# Altium schematic sheet OPA4227.SchDoc
size A4
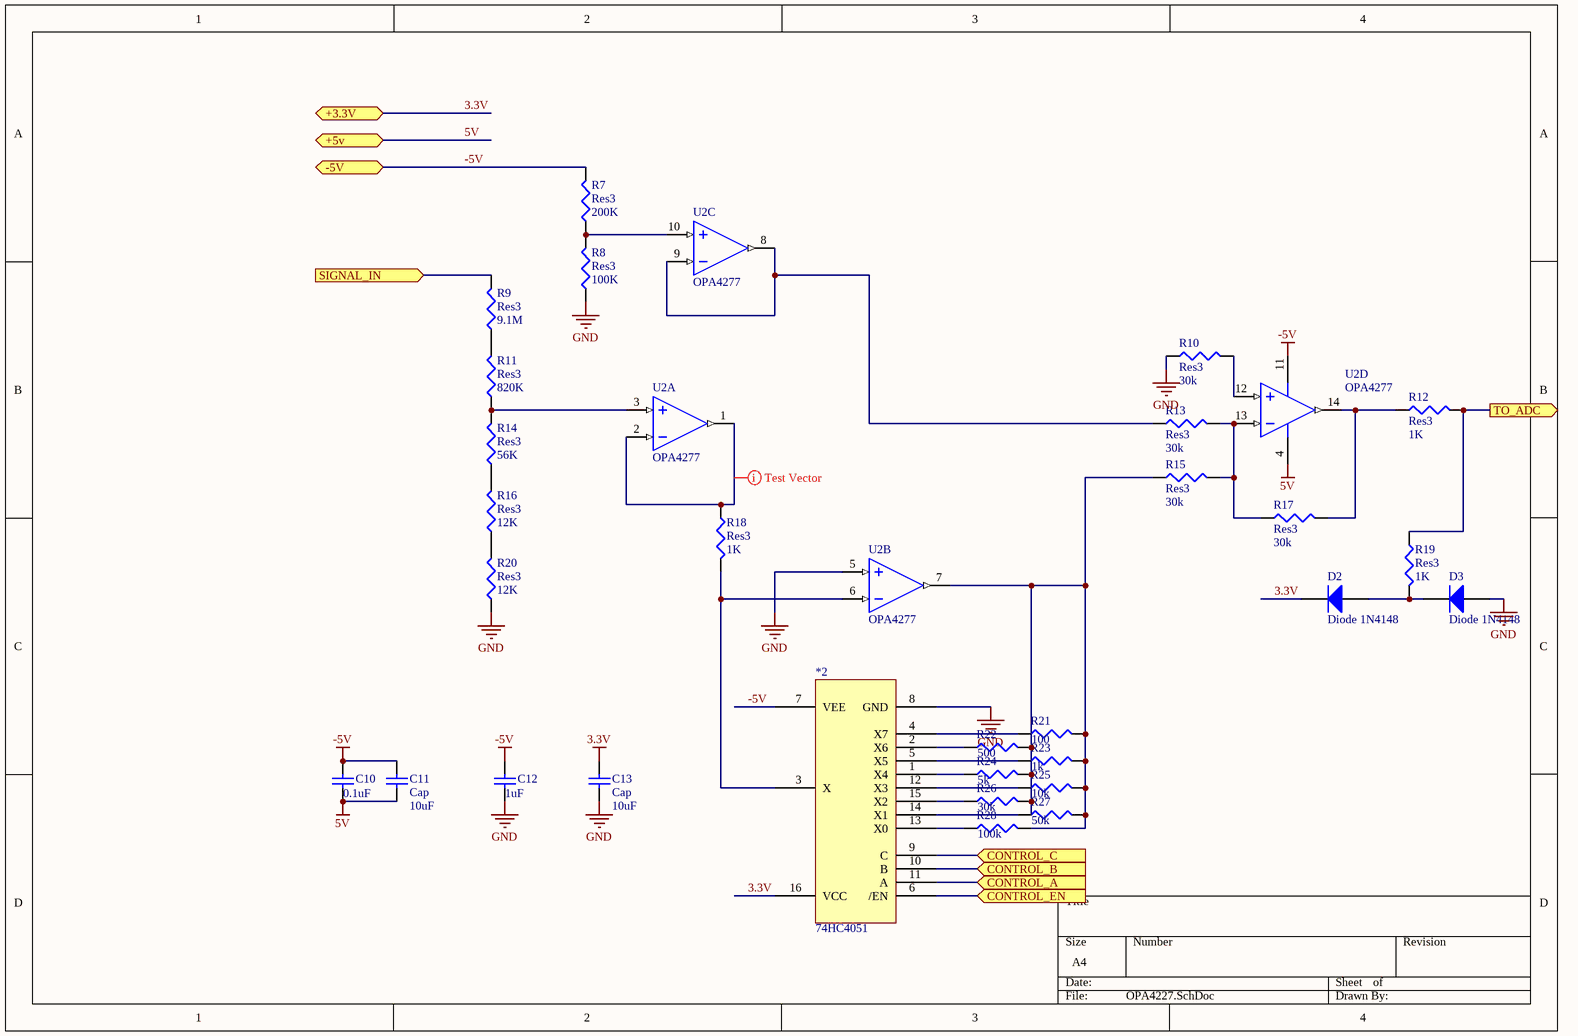
[diagram p0: OPA4227.SchDoc]

## Parts
*2  74HC4051  [SOP-16]
C10  value 0.1uF  [CAP_0603]  (hidden comment: Cap)
C11  Cap  value 10uF  [CAP_0603]
C12  value 1uF  [CAP_0603]  (hidden comment: Cap)
C13  Cap  value 10uF  [CAP_0603]
D2  Diode 1N4148  [DO-35]
D3  Diode 1N4148  [DO-35]
R7  Res3  value 200K  [RES_0603]
R8  Res3  value 100K  [RES_0603]
R9  Res3  value 9.1M  [RES_0603]
R10  Res3  value 30k  [RES_0603]
R11  Res3  value 820K  [RES_0603]
R12  Res3  value 1K  [RES_0603]
R13  Res3  value 30k  [RES_0603]
R14  Res3  value 56K  [RES_0603]
R15  Res3  value 30k  [RES_0603]
R16  Res3  value 12K  [RES_0603]
R17  Res3  value 30k  [RES_0603]
R18  Res3  value 1K  [RES_0603]
R19  Res3  value 1K  [RES_0603]
R20  Res3  value 12K  [RES_0603]
R21  value 100  [RES_0603]  (hidden comment: Res3)
R22  value 500  [RES_0603]  (hidden comment: Res3)
R23  value 1k  [RES_0603]  (hidden comment: Res3)
R24  value 5k  [RES_0603]  (hidden comment: Res3)
R25  value 10k  [RES_0603]  (hidden comment: Res3)
R26  value 30k  [RES_0603]  (hidden comment: Res3)
R27  value 50k  [RES_0603]  (hidden comment: Res3)
R28  value 100k  [RES_0603]  (hidden comment: Res3)
U2  OPA4277  [SO-14]  (parts A,B,C,D of 4)

## Ports
+3.3V, +5v, -5V, CONTROL_A (in), CONTROL_B (in), CONTROL_C (in), CONTROL_EN (in), SIGNAL_IN (in), TO_ADC (out)

## Nets
3.3V: *2.16(VCC) C13.2 D2.2(K) ; port +3.3V
5V: C10.1 C11.1 U2.4(V+) ; port +5v
-5V: *2.7(VEE) C10.2 C11.2 C12.2 R7.2 U2.11(V-) ; port -5V
GND: *2.8(GND) C12.1 C13.1 D3.1(A) R8.1 R10.1 R20.1 U2.5(IN+)
CONTROL_A: *2.11(A) ; port CONTROL_A
CONTROL_B: *2.10(B) ; port CONTROL_B
CONTROL_C: *2.9(C) ; port CONTROL_C
CONTROL_EN: *2.6(/EN) ; port CONTROL_EN
SIGNAL_IN: R9.2 ; port SIGNAL_IN
TO_ADC: R12.2 R19.1 ; port TO_ADC
Net*2_1: *2.1(X4) R24.1
Net*2_2: *2.2(X6) R22.1
Net*2_3: *2.3(X) R18.2 U2.6(IN-)
Net*2_4: *2.4(X7) R21.1
Net*2_5: *2.5(X5) R23.1
Net*2_12: *2.12(X3) R25.1
Net*2_13: *2.13(X0) R28.1
Net*2_14: *2.14(X1) R27.1
Net*2_15: *2.15(X2) R26.1
NetD2_1: D2.1(A) D3.2(K) R19.2
NetR7_1: R7.1 R8.2 U2.10(IN+)
NetR9_1: R9.1 R11.2
NetR10_2: R10.2 U2.12(IN+)
NetR11_1: R11.1 R14.2 U2.3(IN+)
NetR12_1: R12.1 R17.2 U2.14(OUT)
NetR13_1: R13.1 U2.8(OUT) U2.9(IN-)
NetR13_2: R13.2 R15.2 R17.1 U2.13(IN-)
NetR14_1: R14.1 R16.2
NetR15_1: R15.1 R21.2 R22.2 R23.2 R24.2 R25.2 R26.2 R27.2 R28.2 U2.7(OUT)
NetR16_1: R16.1 R20.2
NetR18_1: R18.1 U2.1(OUT) U2.2(IN-)

## Layout directives
Column: TestVectorIndex: NetR18_1

## Library data of the parts
C10-C13 = Cap: Capacitor; Published: 8-Jun-2000; LatestRevisionDate: 17-Jul-2002; LatestRevisionNote: Re-released for DXP Platform.; PackageReference: RAD-0.3; Publisher: Altium Limited
  C11 C13: PackageDescription: Radial Cap, Thru-Hole; 2 Leads; 0.3 in Pin Spacing
D2 D3 = Diode 1N4148: High Conductance Fast Diode; Published: 8-Jun-2000; LatestRevisionDate: 17-Jul-2002; LatestRevisionNote: Re-released for DXP Platform.; DatasheetVersion: 1997; PackageReference: DO-35; Publisher: Altium Limited; PackageDescription: Diode, Axial; Body 3.8 x 1.9 mm (LxDia. max), Lead Dia. 0.53 mm (max); Code_JEDEC: DO-204-AH; ComponentLink1Description: Manufacturer Link; ComponentLink1URL: http://www.fairchildsemi.com/; ComponentLink2Description: Datasheet; ComponentLink2URL: http://www.fairchildsemi.com/ds/1N%2F1N4148.pdf
R7-R28 = Res3: Resistor; Published: 8-Jun-2000; LatestRevisionDate: 29-May-2009; LatestRevisionNote: IPC-7351 Footprint Added.; PackageReference: J1-0603; Publisher: Altium Limited; PackageDescription: Chip Resistor
U2 = OPA4277: High Precision Operational Amplifiers; Text Field7: Published 8-Jun-2000